# EasyEDA Pro project 外接板20250814.eprj

# Schematic Schematic1
Board Name: Board1; Create Date: 2025-08-14; Page Name: P1; Project Name: 外接板20250814; Schematic Name: Schematic1; Update Date: 2025-09-02; Company: 嘉立创EDA; Page Size: A4; Version: V1.0
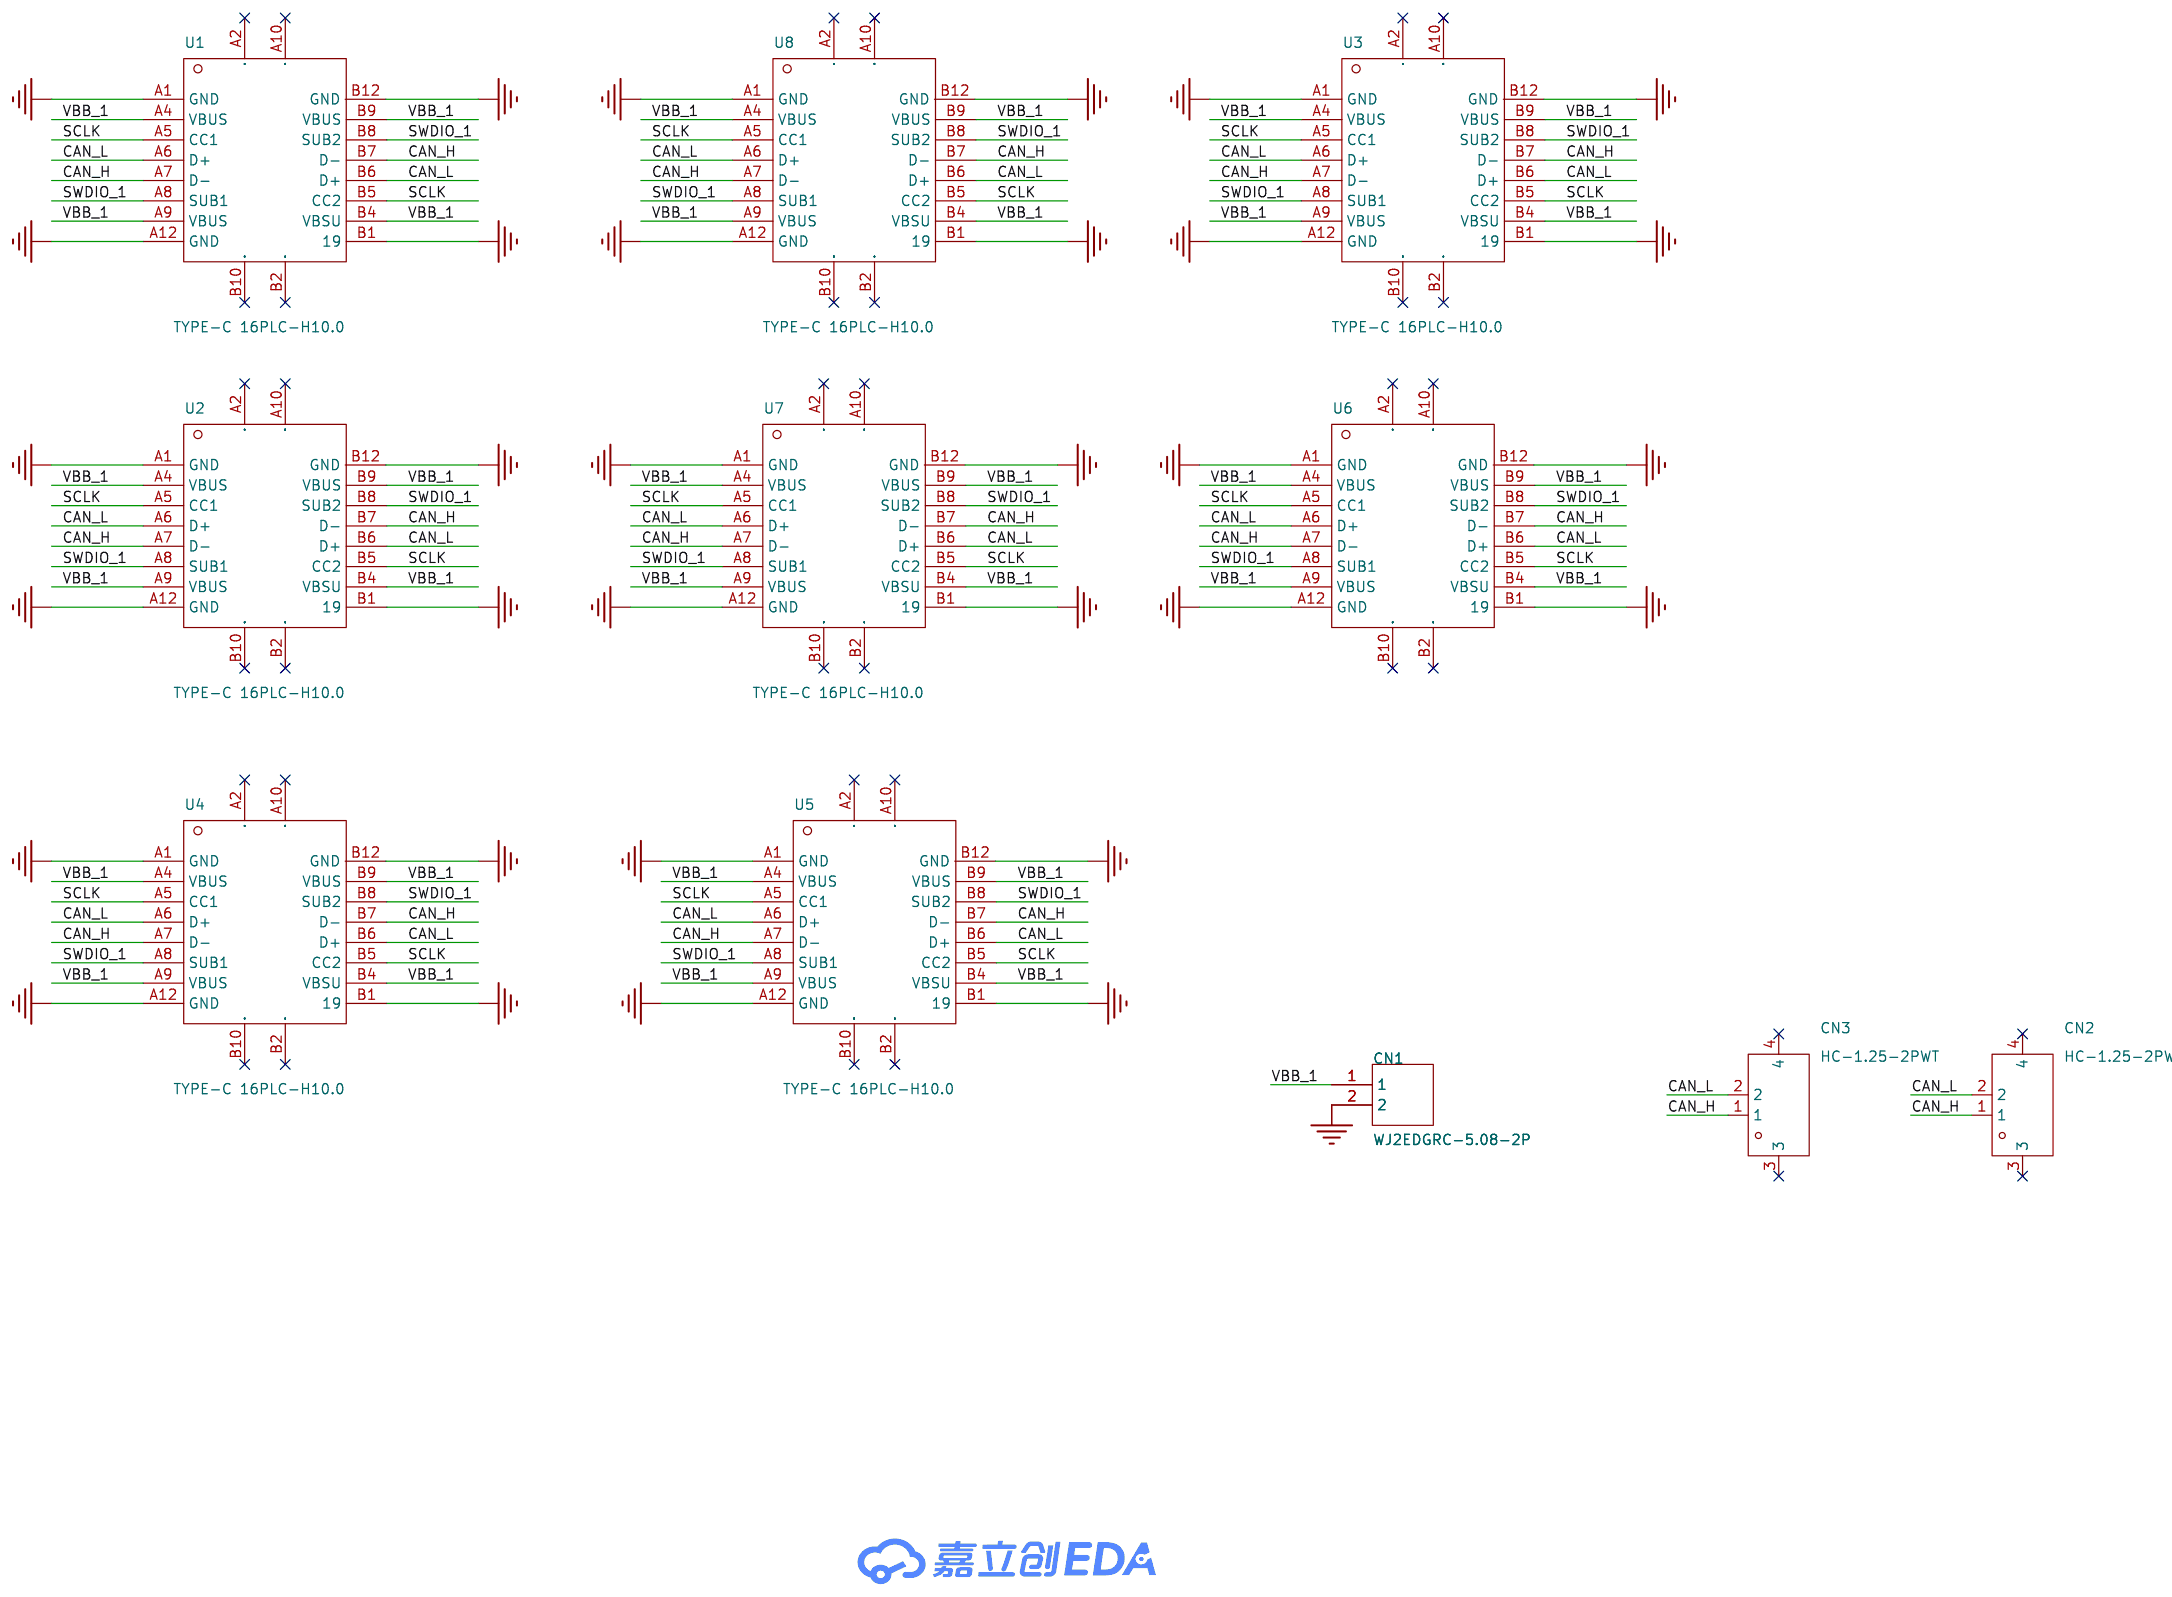
[diagram p0: schematic sheet]

## Parts
CN1  WJ2EDGRC-5.08-2P  [CONN-TH_2P-P5.08_WJ2EDGRC-5.08-2P]
CN2  HC-1.25-2PWT  [CONN-SMD_2P-P1.25-HC-1.25-2PWT]
CN3  HC-1.25-2PWT  [CONN-SMD_2P-P1.25-HC-1.25-2PWT]
U1  TYPE-C 16PLC-H10.0  [TYPE-C-TH_16PLC-H10.0]
U2  TYPE-C 16PLC-H10.0  [TYPE-C-TH_16PLC-H10.0]
U3  TYPE-C 16PLC-H10.0  [TYPE-C-TH_16PLC-H10.0]
U4  TYPE-C 16PLC-H10.0  [TYPE-C-TH_16PLC-H10.0]
U5  TYPE-C 16PLC-H10.0  [TYPE-C-TH_16PLC-H10.0]
U6  TYPE-C 16PLC-H10.0  [TYPE-C-TH_16PLC-H10.0]
U7  TYPE-C 16PLC-H10.0  [TYPE-C-TH_16PLC-H10.0]
U8  TYPE-C 16PLC-H10.0  [TYPE-C-TH_16PLC-H10.0]

## Library data of the parts
CN1 = WJ2EDGRC-5.08-2P: 连接器类型:板端/插座-闭口;固定方式:-;结构:1x2P;间距:5.08mm;颜色:绿色;安装方式:弯针;排数:1;每排PIN数:2;额定电流:20A;额定电压:450V;线规 - AWG:-;线规 - 平方毫米:-;触头材质:黄铜;触头镀层:锡;工作温度范围:-40℃~+105℃;焊接温度(最大值):-;; LCSC Part Name: 1x2P 5.08mm 排数:1 每排P数:2; Supplier Part: C3697; Manufacturer: KANGNEX(康奈克斯电气); Supplier Footprint: 弯插,P=5.08mm; JLCPCB Part Class: 扩展库; Datasheet: https://atta.szlcsc.com/upload/public/pdf/source/20240813/4D8AF133EBD88DD18E5AA0CE5EC77AA3.pdf; Supplier: LCSC; Connector Type: 板端/插座-闭口; Structure: 1x2P; Pitch: 5.08mm; Color: 绿色; Mounting Style: 弯针; Number of Pins: 2P; Number of Rows: 1; Number of PINs Per Row: 2; Current Rating (Max): 20A; Voltage Rating (Max): 450V; Contact Material: 黄铜; Contact Plating: 锡; Operating Temperature Range: -40℃~+105℃
CN2 CN3 = HC-1.25-2PWT: 插针结构:1x2P;间距:1.25mm;安装方式:卧贴;参考系列:PicoBlade(MX 1.25);总PIN数:2P;排数:1;每排PIN数:2;行距:-;额定电流:1A;触头材质:黄铜;触头镀层:锡;工作温度范围:-40℃~+105℃;; LCSC Part Name: 1x2P 间距:1.25mm 卧贴 系列:PicoBlade(MX 1.25); Supplier Part: C2845379; Manufacturer: HCTL(华灿天禄); Supplier Footprint: SMD,P=1.25mm,卧贴; JLCPCB Part Class: 扩展库; Datasheet: https://atta.szlcsc.com/upload/public/pdf/source/20240930/9508A8292CCC87B0C29E3A028D56E30A.pdf; Supplier: LCSC; Pins Structure: 1x2P; Pitch: 1.25mm; Mounting Style: 卧贴; Reference Series: PicoBlade(MX 1.25); Number of Pins: 2P; Number of Rows: 1; Number of PINs Per Row: 2; Current Rating (Max): 1A; Contact Material: 黄铜; Contact Plating: 锡; Operating Temperature Range: -40℃~+105℃; Rated Voltage (Max): 125V; Plastic Material: LCP; Flame Retardant Rating: UL94V-0; Supplementary Features: 辅助焊脚; Z-Height of the Board: 3.57mm; X-Length of Bottom Edge on Board (Spacing Line): 7.55mm; Y-Width of Bottom Edge on Board: 5.25mm
U1-U8 = TYPE-C 16PLC-H10.0: 连接器类型:Type-C;标准:USB 3.1;公母:母;安装方式:直插;触点数量:16P;端口数量:1;额定电流 - 电源:5A;触头材质:-;触头镀层:-;工作温度范围:-40℃~+85℃;; LCSC Part Name: Type-C 母 直插; Supplier Part: C3151747; Manufacturer: SHOU HAN(首韩); Supplier Footprint: 插件; JLCPCB Part Class: 扩展库; Datasheet: https://atta.szlcsc.com/upload/public/pdf/source/20240529/CC9428849977884A813B584EA396EFE9.pdf; Supplier: LCSC; Connector Type: Type-C; Standard: USB 3.1; Gender: 母; Mounting Style: 直插; Number of Contacts: 16P; Number of Ports: 1; Current Rating - Power (Max): 5A; Operating Temperature Range: -40℃~+85℃; Rated Voltage (Max): 20V; Connect-Disconnect Life: 1万次; Core Colour: 黑色

## Nets
GND: CN1.2 U1.A1(GND) U1.A12(GND) U1.B1(19) U1.B12(GND) U2.A1(GND) U2.A12(GND) U2.B1(19) U2.B12(GND) U3.A1(GND) U3.A12(GND) U3.B1(19) U3.B12(GND) U4.A1(GND) U4.A12(GND) U4.B1(19) U4.B12(GND) U5.A1(GND) U5.A12(GND) U5.B1(19) U5.B12(GND) U6.A1(GND) U6.A12(GND) U6.B1(19) U6.B12(GND) U7.A1(GND) U7.A12(GND) U7.B1(19) U7.B12(GND) U8.A1(GND) U8.A12(GND) U8.B1(19) U8.B12(GND)
CAN_H: CN2.1 CN3.1 U1.A7(D-) U1.B7(D-) U2.A7(D-) U2.B7(D-) U3.A7(D-) U3.B7(D-) U4.A7(D-) U4.B7(D-) U5.A7(D-) U5.B7(D-) U6.A7(D-) U6.B7(D-) U7.A7(D-) U7.B7(D-) U8.A7(D-) U8.B7(D-)
CAN_L: CN2.2 CN3.2 U1.A6(D+) U1.B6(D+) U2.A6(D+) U2.B6(D+) U3.A6(D+) U3.B6(D+) U4.A6(D+) U4.B6(D+) U5.A6(D+) U5.B6(D+) U6.A6(D+) U6.B6(D+) U7.A6(D+) U7.B6(D+) U8.A6(D+) U8.B6(D+)
SCLK: U1.A5(CC1) U1.B5(CC2) U2.A5(CC1) U2.B5(CC2) U3.A5(CC1) U3.B5(CC2) U4.A5(CC1) U4.B5(CC2) U5.A5(CC1) U5.B5(CC2) U6.A5(CC1) U6.B5(CC2) U7.A5(CC1) U7.B5(CC2) U8.A5(CC1) U8.B5(CC2)
SWDIO_1: U1.A8(SUB1) U1.B8(SUB2) U2.A8(SUB1) U2.B8(SUB2) U3.A8(SUB1) U3.B8(SUB2) U4.A8(SUB1) U4.B8(SUB2) U5.A8(SUB1) U5.B8(SUB2) U6.A8(SUB1) U6.B8(SUB2) U7.A8(SUB1) U7.B8(SUB2) U8.A8(SUB1) U8.B8(SUB2)
VBB_1: CN1.1 U1.A4(VBUS) U1.A9(VBUS) U1.B4(VBSU) U1.B9(VBUS) U2.A4(VBUS) U2.A9(VBUS) U2.B4(VBSU) U2.B9(VBUS) U3.A4(VBUS) U3.A9(VBUS) U3.B4(VBSU) U3.B9(VBUS) U4.A4(VBUS) U4.A9(VBUS) U4.B4(VBSU) U4.B9(VBUS) U5.A4(VBUS) U5.A9(VBUS) U5.B4(VBSU) U5.B9(VBUS) U6.A4(VBUS) U6.A9(VBUS) U6.B4(VBSU) U6.B9(VBUS) U7.A4(VBUS) U7.A9(VBUS) U7.B4(VBSU) U7.B9(VBUS) U8.A4(VBUS) U8.A9(VBUS) U8.B4(VBSU) U8.B9(VBUS)

Not connected (* = marked no-connect by the designer): CN2 3* 4*; CN3 3* 4*; U1 A2(GND1)* A10(GND2)* B2(GND4)* B10(GND3)*; U2 A2(GND1)* A10(GND2)* B2(GND4)* B10(GND3)*; U3 A2(GND1)* A10(GND2)* B2(GND4)* B10(GND3)*; U4 A2(GND1)* A10(GND2)* B2(GND4)* B10(GND3)*; U5 A2(GND1)* A10(GND2)* B2(GND4)* B10(GND3)*; U6 A2(GND1)* A10(GND2)* B2(GND4)* B10(GND3)*; U7 A2(GND1)* A10(GND2)* B2(GND4)* B10(GND3)*; U8 A2(GND1)* A10(GND2)* B2(GND4)* B10(GND3)*

# Board PCB5
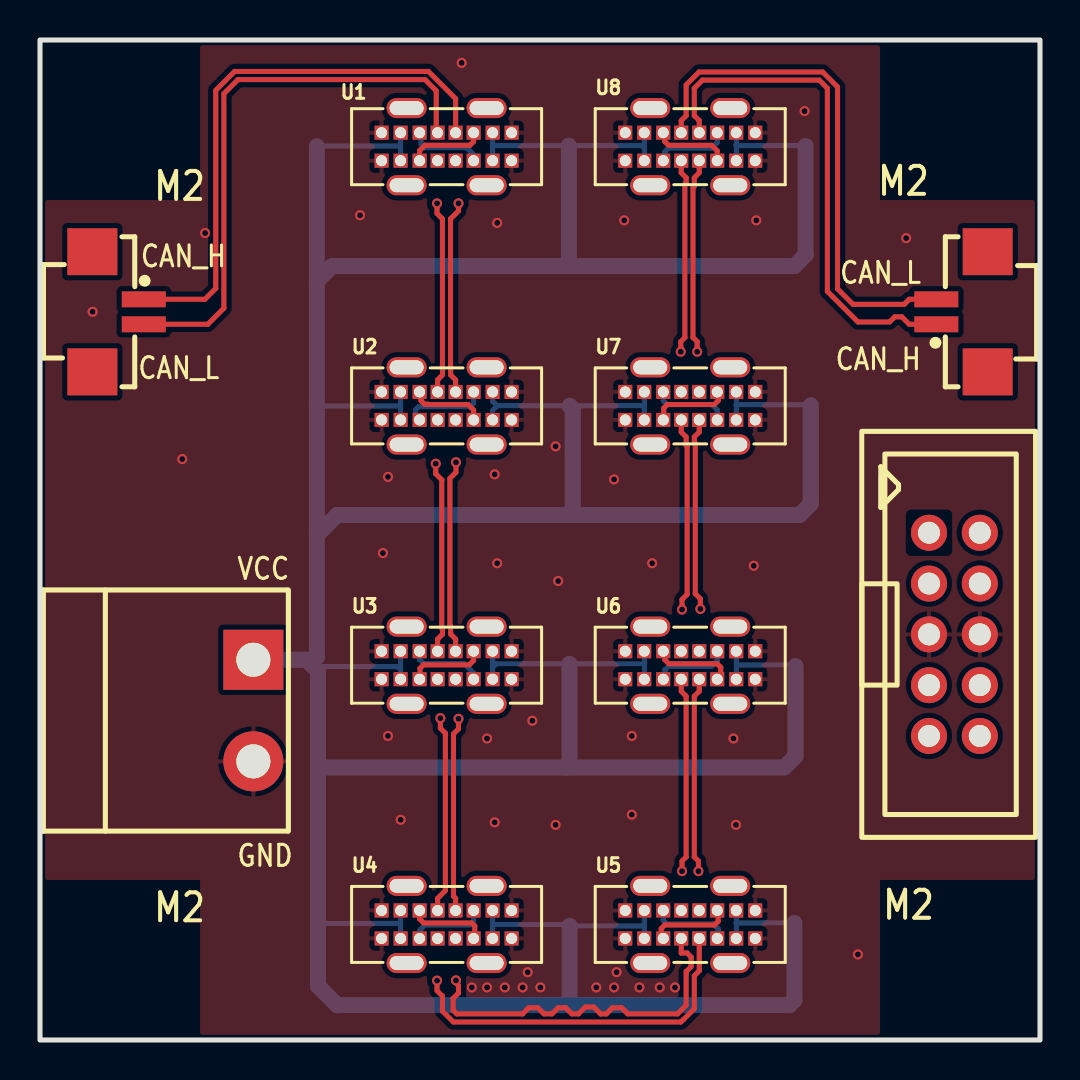
[diagram p1: board, top side]
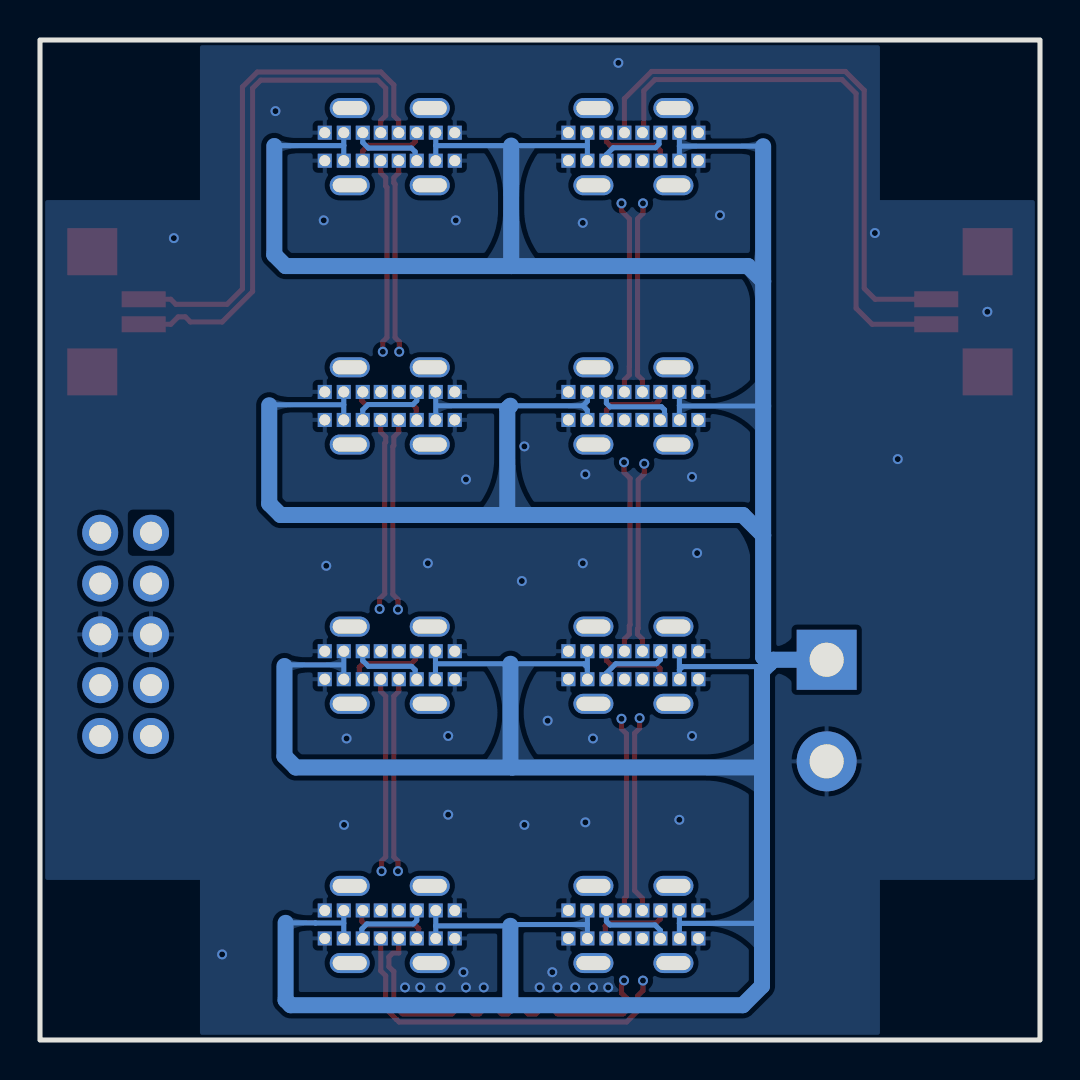
[diagram p2: board, bottom side, seen from below]

Outline 50 x 50 mm; copper layers: Top Layer, 内层1, 内层2, Bottom Layer. Coordinates in mm from the lower left corner of the outline.
Outline path: rectangle 0,50 50,0
Stack: Top Layer 0.035mm 外层铜厚1oz / Dielectric1 0.2104mm 7628 RC49% 8.6mil / 内层1 0.0152mm 内层铜厚 / Dielectric2 1.065mm 1.1mm H/HOZ Copper / 内层2 0.0152mm 内层铜厚 / Dielectric3 0.2104mm 7628 RC49% 8.6mil / Bottom Layer 0.035mm 外层铜厚1oz

## Design rules (mm)
net CAN_L: DP1
net CAN_H: DP1
template: JLCPCB Capability(Two Layers Board)
spacing copperThickness1oz (default): track to track 0.102, other pairs 0.152 to 0.3
spacing copperThickness2oz: track to track 0.203, other pairs 0.152 to 0.3
track width copperThickness1oz (default): min 0.127, default 0.254, max 2.54
track width copperThickness2oz: min 0.203, default 0.254, max 2.54
differential pair differentialPair (default): width min 0.127, default 0.254, max 2.54; gap min 0.152, default 0.152
via viaSize (default): diameter min 0.5, default 0.61, max 10; hole min 0.3, default 0.305, max 6.3

## Placement (name value [footprint] x y rotation side)
CN1  WJ2EDGRC-5.08-2P  [CONN-TH_2P-P5.08_WJ2EDGRC-5.08-2P]  10.67 16.47 270 top
CN2  HC-1.25-2PWT  [CONN-SMD_2P-P1.25-HC-1.25-2PWT]  46.1 36.41 90 top
CN3  HC-1.25-2PWT  [CONN-SMD_2P-P1.25-HC-1.25-2PWT]  3.9 36.41 270 top
NOREF  -  [Pad_e233]  44.45 20.28 0 top
NOREF#2  -  [Pad_e232]  46.99 20.28 0 top
NOREF#3  -  [Pad_e249]  44.45 22.82 0 top
NOREF#4  -  [Pad_e236]  46.99 17.74 0 top
NOREF#5  -  [Pad_e247]  44.45 15.2 0 top
NOREF#6  -  [Pad_e237]  46.99 15.2 0 top
NOREF#7  -  [Pad_e250]  44.45 25.36 0 top
NOREF#8  -  [Pad_e248]  44.45 17.74 0 top
NOREF#9  -  [Pad_e229]  46.99 22.82 0 top
NOREF#10  -  [Pad_e231]  46.99 25.36 0 top
U1  TYPE-C 16PLC-H10.0  [TYPE-C-TH_16PLC-H10.0]  20.33 44.67 0 top
U2  TYPE-C 16PLC-H10.0  [TYPE-C-TH_16PLC-H10.0]  20.33 31.7 0 top
U3  TYPE-C 16PLC-H10.0  [TYPE-C-TH_16PLC-H10.0]  20.33 18.74 0 top
U4  TYPE-C 16PLC-H10.0  [TYPE-C-TH_16PLC-H10.0]  20.33 5.78 0 top
U5  TYPE-C 16PLC-H10.0  [TYPE-C-TH_16PLC-H10.0]  32.51 5.78 0 top
U6  TYPE-C 16PLC-H10.0  [TYPE-C-TH_16PLC-H10.0]  32.51 18.74 0 top
U7  TYPE-C 16PLC-H10.0  [TYPE-C-TH_16PLC-H10.0]  32.51 31.7 0 top
U8  TYPE-C 16PLC-H10.0  [TYPE-C-TH_16PLC-H10.0]  32.51 44.67 0 top

## Footprints (pads in the part's own frame, mm; a bottom-side part is the same pattern mirrored in y, then rotated)
CONN-SMD_2P-P1.25-HC-1.25-2PWT
  rect 0.8x2.2 smd: 1(-0.625,1.285) 2(0.625,1.285)
  rect 2.35x2.5 smd: 3(-3.005,-1.285) 4(3.005,-1.285)
CONN-TH_2P-P5.08_WJ2EDGRC-5.08-2P
  rect 3x3 hole 1.7: 1(-2.54,0)
  round 3 hole 1.7: 2(2.54,0)
Pad_e229
  round 1.8 hole 1.1: 1(0,0)
Pad_e231
  round 1.8 hole 1.1: 1(0,0)
Pad_e232
  round 1.8 hole 1.1: 1(0,0)
Pad_e233
  round 1.8 hole 1.1: 1(0,0)
Pad_e236
  round 1.8 hole 1.1: 1(0,0)
Pad_e237
  round 1.8 hole 1.1: 1(0,0)
Pad_e247
  round 1.8 hole 1.1: 1(0,0)
Pad_e248
  round 1.8 hole 1.1: 1(0,0)
Pad_e249
  round 1.8 hole 1.1: 1(0,0)
Pad_e250
  round 1.8 hole 1.1: 1(0,0)
TYPE-C-TH_16PLC-H10.0
  rect 0.7x0.7 hole 0.55: A1(-3.25,0.7) A4(-2.3,0.7) A5(-1.351,0.7) A6(-0.45,0.7) A7(0.45,0.7) A8(1.35,0.7) A9(2.3,0.7) A12(3.25,0.7) B1(3.25,-0.7) B4(2.3,-0.7) B5(1.35,-0.7) B6(0.45,-0.7) B7(-0.45,-0.7) B8(-1.351,-0.7) B9(-2.3,-0.7) B12(-3.25,-0.7)
  oval 2x1 hole 1.7x0.7: A2(-2,1.93) A10(2,1.93) B2(2,-1.93) B10(-2,-1.93)

## Nets
GND: CN1.2 NOREF.1 NOREF#2.1 U1.A1 U1.A12 U1.B1 U1.B12 U2.A1 U2.A12 U2.B1 U2.B12 U3.A1 U3.A12 U3.B1 U3.B12 U4.A1 U4.A12 U4.B1 U4.B12 U5.A1 U5.A12 U5.B1 U5.B12 U6.A1 U6.A12 U6.B1 U6.B12 U7.A1 U7.A12 U7.B1 U7.B12 U8.A1 U8.A12 U8.B1 U8.B12
CAN_H: CN2.1 CN3.1 U1.A7 U1.B7 U2.A7 U2.B7 U3.A7 U3.B7 U4.A7 U4.B7 U5.A7 U5.B7 U6.A7 U6.B7 U7.A7 U7.B7 U8.A7 U8.B7
CAN_L: CN2.2 CN3.2 U1.A6 U1.B6 U2.A6 U2.B6 U3.A6 U3.B6 U4.A6 U4.B6 U5.A6 U5.B6 U6.A6 U6.B6 U7.A6 U7.B6 U8.A6 U8.B6
SCLK: NOREF#10.1 U1.A5 U1.B5 U2.A5 U2.B5 U3.A5 U3.B5 U4.A5 U4.B5 U5.A5 U5.B5 U6.A5 U6.B5 U7.A5 U7.B5 U8.A5 U8.B5
SWDIO_1: NOREF#9.1 U1.A8 U1.B8 U2.A8 U2.B8 U3.A8 U3.B8 U4.A8 U4.B8 U5.A8 U5.B8 U6.A8 U6.B8 U7.A8 U7.B8 U8.A8 U8.B8
VBB_1: CN1.1 U1.A4 U1.A9 U1.B4 U1.B9 U2.A4 U2.A9 U2.B4 U2.B9 U3.A4 U3.A9 U3.B4 U3.B9 U4.A4 U4.A9 U4.B4 U4.B9 U5.A4 U5.A9 U5.B4 U5.B9 U6.A4 U6.A9 U6.B4 U6.B9 U7.A4 U7.A9 U7.B4 U7.B9 U8.A4 U8.A9 U8.B4 U8.B9

Pads without a net: CN2 3 4; CN3 3 4; NOREF#3 1; NOREF#4 1; NOREF#5 1; NOREF#6 1; NOREF#7 1; NOREF#8 1; U1 A2 A10 B2 B10; U2 A2 A10 B2 B10; U3 A2 A10 B2 B10; U4 A2 A10 B2 B10; U5 A2 A10 B2 B10; U6 A2 A10 B2 B10; U7 A2 A10 B2 B10; U8 A2 A10 B2 B10

## Via types
v1: diameter 0.5, hole 0.3, Top Layer to Bottom Layer, 56 vias

## Routing (per net, layer and track width the routed paths; a pad name or vN(x,y) marks a point on that pad's centre or on a via; arc(x,y) is an arc through that point)
GND:
  vias: v1(2.63,36.41) v1(7.11,29.05) v1(8.25,40.35) v1(16,41.24) v1(17.15,24.35) v1(17.4,28.16) v1(17.4,15.2) v1(18.03,11.01) v1(21.08,48.86) v1(21.59,2.63) v1(22.35,15.08) v1(22.35,2.63) v1(22.73,28.28) v1(22.73,10.88) v1(22.86,40.86) v1(22.86,23.84) v1(23.24,2.63) v1(24.13,2.63) v1(24.38,3.39) v1(24.62,15.96) v1(25.02,2.63) v1(25.78,29.68) v1(25.78,10.76) v1(25.91,22.95) v1(27.81,2.63) v1(28.7,28.03) v1(28.7,2.63) v1(28.83,3.39) v1(29.21,40.98) v1(29.59,15.2) v1(29.59,11.27) v1(29.97,2.63) v1(30.61,23.84) v1(30.99,2.63) v1(31.75,2.63) v1(34.67,15.08) v1(34.8,10.76) v1(35.69,23.71) v1(35.81,40.98) v1(38.23,46.44) v1(40.89,4.28) v1(43.31,40.09)
CAN_H: length 164.8
  Top Layer w0.254: U8.A7 32.96,45.97 32.72,46.22 32.72,47.59 33.12,47.99 38.96,47.99 39.37,47.59 39.37,37.43 40.89,35.9 42.48,35.9 42.74,36.16 43.09,36.16 43.46,35.79 CN2.1 ; v1(20.8,28.89) 20.8,28.38 20.5,28.08 20.5,20.75 20.53,20.71 20.53,20.29 20.78,20.04 U3.A7 ; v1(32.1,8.44) 32.1,8.95 32.31,9.15 32.31,17.19 32.06,17.44 U6.B7 ; U5.B7 32.06,4.35 32.36,4.35 32.56,4.15 32.56,3.67 32.32,3.43 32.31,3.43 32.31,1.74 31.88,1.31 29.39,1.31 29.08,1.61 28.63,1.61 28.32,1.31 28.03,1.31 27.69,1.65 27.27,1.65 26.92,1.31 26.6,1.31 26.29,1.61 25.91,1.61 25.6,1.31 25.2,1.31 24.89,1.61 24.44,1.61 24.13,1.31 20.84,1.31 20.66,1.49 20.66,2.08 20.93,2.35 20.93,2.73 20.8,2.85 v1(20.8,2.98) ; v1(32.04,34.41) 32.04,34.92 32.25,35.12 32.25,42.8 32.31,42.86 32.31,43.11 32.06,43.36 U8.B7 ; U7.B7 32.06,30.4 32.31,30.15 32.31,29.73 32.36,29.68 32.36,22.28 32.1,22.03 v1(32.1,21.52) ; U1.A7 20.78,47.07 19.42,48.43 9.73,48.43 8.79,47.49 8.79,37.58 8.25,37.04 CN3.1 ; v1(20.93,16.06) 20.93,15.56 20.68,15.31 20.68,7.19 20.78,7.08 U4.A7 ; v1(20.93,41.83) 20.93,41.46 20.53,41.06 20.53,33.68 20.53,33.68 20.53,33.25 20.78,33.01 U2.A7
  内层1 w0.254: v1(20.8,28.89) 19.88,29.81 U2.B7 19.88,31.47 20.07,31.66 20.57,31.66 20.78,31.87 U2.A7 ; U6.B7 32.06,18.56 32.26,18.76 32.71,18.76 32.96,19.01 U6.A7 32.96,20.66 v1(32.1,21.52) ; U1.A7 20.78,44.87 20.57,44.67 20.07,44.67 19.88,44.48 U1.B7 19.94,43.9 19.94,42.95 20.86,42.03 20.86,41.9 v1(20.93,41.83) ; U8.B7 32.06,44.44 32.26,44.63 32.8,44.63 32.96,44.79 U8.A7 ; v1(20.8,2.98) 19.88,3.9 U4.B7 19.88,5.63 20.04,5.78 20.55,5.78 20.78,6.01 U4.A7 ; U3.A7 20.78,18.96 20.56,18.75 20.07,18.75 19.88,18.56 U3.B7 20.01,17.91 20.01,16.98 v1(20.93,16.06) ; v1(32.04,34.41) 32.96,33.49 U7.A7 32.96,31.84 32.8,31.68 32.22,31.68 32.06,31.52 U7.B7 ; U5.B7 32.06,5.59 32.26,5.79 32.75,5.79 32.78,5.75 32.96,5.93 U5.A7 32.96,7.58 v1(32.1,8.44)
CAN_L: length 164.9
  Top Layer w0.254: U7.B6 32.96,30.4 32.72,30.15 32.72,29.9 32.76,29.85 32.76,22.31 33.02,22.06 v1(33.02,21.55) ; v1(32.86,34.41) 32.86,34.92 32.65,35.12 32.65,42.63 32.72,42.69 32.72,43.11 32.96,43.36 U8.B6 ; v1(19.79,28.81) 19.79,28.31 20.09,28.01 20.09,20.58 20.13,20.55 20.13,20.29 19.88,20.04 U3.A6 ; CN3.2 8.39,35.79 9.19,36.59 9.19,47.32 9.9,48.02 19.25,48.02 19.81,47.46 19.81,45.43 ; U2.A6 19.88,33.01 20.13,33.25 20.13,33.51 20.12,33.51 20.12,41.06 19.85,41.33 v1(19.85,41.83) ; U6.B6 32.96,17.44 32.72,17.19 32.72,9.15 32.92,8.95 v1(32.92,8.44) ; v1(19.85,2.97) 19.85,2.47 20.12,2.2 20.12,1.44 20.67,0.9 32.05,0.9 32.17,1.03 32.18,1.03 32.72,1.56 32.72,3.21 32.96,3.46 U5.B6 ; U4.A6 19.88,7.08 20.27,7.47 20.27,15.34 20.02,15.59 v1(20.02,16.09) ; CN2.2 43.46,37.04 43.21,36.78 40.65,36.78 39.88,37.55 39.88,47.65 39.13,48.4 32.95,48.4 32.31,47.76 32.31,46.22 32.06,45.97 U8.A6
  内层2 w0.254: v1(32.86,34.41) 32.06,33.62 U7.A6 32.06,31.84 32.22,31.68 32.77,31.68 32.96,31.48 U7.B6 ; v1(19.85,2.97) 20.78,3.9 U4.B6 20.78,5.6 20.57,5.8 20.07,5.8 19.88,5.99 U4.A6 ; v1(19.79,28.81) 20.78,29.81 U2.B6 20.78,31.51 20.57,31.71 20.07,31.71 19.88,31.9 U2.A6 ; U3.A6 19.88,18.94 20.07,18.76 20.57,18.76 20.78,18.55 U3.B6 20.78,16.73 20.15,16.09 v1(20.02,16.09) ; U8.B6 32.96,44.47 32.77,44.67 32.26,44.67 32.06,44.86 U8.A6 ; v1(32.92,8.44) 32.06,7.58 U5.A6 32.06,5.93 32.22,5.77 32.77,5.77 32.96,5.57 U5.B6 ; v1(19.85,41.83) 19.98,41.83 20.91,42.76 20.91,43.84 U1.B6 20.78,44.4 20.52,44.67 20.07,44.67 19.88,44.85 U1.A6 ; U6.B6 32.96,18.47 32.77,18.66 32.53,18.66 32.53,18.67 32.22,18.67 32.06,18.83 U6.A6 32.06,20.59 v1(33.02,21.55)
SCLK: length 160.3
  Top Layer w0.254: U6.A5 31.24,19.36 31.24,19.01 31.44,18.81 33.86,18.81 34.04,18.64 34.04,18.11 33.97,18.04 U6.B5 ; U2.B5 21.68,31.5 21.4,31.77 19.41,31.77 19.4,31.79 19.23,31.79 19.05,31.97 19.05,32.33 U2.A5 ; U4.B5 21.74,5.14 21.74,5.7 21.59,5.85 19.19,5.85 18.98,6.06 U4.A5 ; U8.A5 31.24,45.29 31.24,44.92 31.43,44.74 33.58,44.74 33.86,44.46 U8.B5
  内层2 w0.254: 37.57,31.71 37.57,44.43 37.29,44.72 34.04,44.72 33.86,44.54 U8.B5 ; 37.57,31.71 37.51,31.76 34.09,31.76 33.91,31.58 33.91,31.05 U7.B5 ; 37.57,31.71 37.57,28.27 ; 25.15,18.64 25.1,18.68 21.9,18.68 21.72,18.5 21.72,18.08 U3.B5 ; 25.15,18.64 25.15,5.8 25.07,5.73 ; 25.15,18.64 25.15,31.76 ; 25.15,31.76 25.15,44.41 24.96,44.59 21.79,44.59 21.72,44.52 21.72,44 U1.B5 ; 25.15,31.76 21.9,31.76 21.72,31.58 21.72,31.04 U2.B5 ; 37.57,28.27 46.37,28.27 47.12,27.52 47.12,25.49 NOREF#10.1 ; 37.57,28.27 37.57,18.66 ; U4.B5 21.72,5.11 21.72,5.55 21.9,5.73 25.07,5.73 ; 25.07,5.73 30.86,5.73 31.16,6.03 U5.A5 ; 37.57,18.66 37.55,18.68 34.09,18.68 33.91,18.5 33.91,18.09 U6.B5 ; 37.57,18.66 37.57,6.33 37.08,5.85 33.91,5.85 33.86,5.8 U5.B5
  Bottom Layer w0.254: U3.B5 21.68,18.34 21.21,18.81 19.18,18.81 18.98,19.01 U3.A5 ; U1.A5 19.05,45.3 19.05,44.79 19.23,44.61 21.34,44.61 21.68,44.27 U1.B5 ; U7.B5 33.86,31.5 33.59,31.77 31.35,31.77 31.16,31.97 U7.A5 ; U5.B5 33.91,5.12 33.91,5.55 33.66,5.8 31.34,5.8 31.16,5.98 U5.A5
SWDIO_1: length 132
  Top Layer w0.254: U3.B8 19,18.06 19,18.58 19.18,18.76 21.46,18.76 21.68,18.97 U3.A8 ; U1.A8 21.68,44.92 21.5,44.74 19.25,44.74 18.98,44.47 U1.B8 ; U5.A8 33.91,6.43 33.91,5.93 33.73,5.75 31.24,5.75 31.06,5.57 31.06,5.18 U5.B8 ; U7.B8 31.19,31.03 31.19,31.59 31.37,31.77 33.72,31.77 33.91,31.97 33.91,32.36 U7.A8
  内层1 w0.254: U4.A8 21.72,6.44 21.72,5.93 21.9,5.75 26.4,5.75 ; 26.54,44.74 24.05,44.74 24.05,44.74 22.16,44.74 22.16,44.74 21.9,44.74 21.72,44.92 21.72,45.33 U1.A8 ; 26.54,44.74 26.59,44.74 26.61,44.72 31.06,44.72 31.24,44.54 31.24,44.05 U8.B8 ; 26.54,44.74 26.54,31.86 ; 26.51,18.71 26.4,18.59 26.4,5.75 ; 26.51,18.71 26.54,18.74 ; 26.51,18.71 21.9,18.71 21.72,18.89 21.72,19.4 U3.A8 ; U7.B8 31.16,31.58 30.98,31.76 26.64,31.76 26.54,31.86 ; 26.54,31.86 26.54,18.74 ; 26.54,31.86 26.45,31.77 22.16,31.77 21.68,32.26 U2.A8 ; 26.4,5.75 30.79,5.75 31.16,5.38 U5.B8 ; 26.54,18.74 26.62,18.81 30.98,18.81 31.16,18.63 U6.B8 ; U6.A8 33.86,18.93 34.1,18.69 38.86,18.69 39.37,19.2 39.37,23.46 39.94,24.03 45.85,24.03 46.99,22.89 NOREF#9.1
  Bottom Layer w0.254: U4.B8 18.98,5.48 19.25,5.75 21.5,5.75 21.68,5.93 U4.A8 ; U8.B8 31.24,44.05 31.24,44.41 31.43,44.59 33.58,44.59 33.86,44.87 U8.A8 ; U2.A8 21.68,31.84 21.5,31.66 18.92,31.66 18.77,31.51 18.77,31.19 18.97,31 U2.B8 ; U6.A8 33.86,18.97 33.58,18.68 31.42,18.68 31.24,18.5 31.24,18.12 U6.B8
VBB_1: length 266.1
  Bottom Layer w0.254: 30.21,44.72 26.44,44.72 26.44,44.72 22.63,44.72 ; 30.21,44.72 U8.B9 ; 30.21,44.72 U8.A4 ; U6.B9 30.23,18.05 30.23,18.84 ; 18.03,44.69 U1.A4 ; 18.03,44.69 U1.B9 ; 18.03,44.69 13.85,44.69 13.84,44.69 ; 30.23,18.84 30.2,18.81 22.81,18.81 22.63,18.63 ; 30.23,18.84 30.23,19.43 U6.A4 ; 22.63,5.77 U4.B4 ; 22.63,5.77 26.42,5.77 26.48,5.71 30.21,5.71 30.21,5.71 ; 22.63,5.77 U4.A9 ; 37.72,5.86 36.24,5.86 36.23,5.85 34.83,5.85 34.81,5.84 ; U4.B9 18.03,5.83 ; 18.03,5.83 13.92,5.83 13.9,5.85 ; 18.03,5.83 U4.A4 ; 30.21,5.71 U5.A4 ; 30.21,5.71 U5.B9 ; U7.B4 U7.A9 ; U8.A9 34.81,44.73 ; 34.81,44.73 34.82,44.72 38.26,44.72 38.28,44.7 ; 34.81,44.73 U8.B4 ; 34.81,31.76 38.51,31.76 38.54,31.73 ; U3.A9 22.63,18.63 ; 22.63,18.63 U3.B4 ; 34.93,18.76 37.72,18.76 37.78,18.7 ; 18.03,31.72 U2.B9 ; 18.03,31.72 18,31.7 13.84,31.7 ; 18.03,31.72 U2.A4 ; U5.A9 34.81,5.84 ; 34.81,5.84 U5.B4 ; U2.B4 22.63,31.48 22.86,31.71 ; U7.A4 U7.B9 ; 30.1,31.71 22.86,31.71 ; U3.A4 18.03,18.51 ; 18.03,18.51 U3.B9 ; 18.03,18.51 17.87,18.67 14.12,18.67 13.9,18.45 ; 22.63,44.72 U1.B4 ; 22.63,44.72 U1.A9 ; 22.86,31.71 22.63,31.94 U2.A9 ; U6.A9 U6.B4
  Bottom Layer w0.8: 13.9,13.5 13.9,2.7 14.86,1.74 26.42,1.74 ; 13.9,13.5 14.03,13.63 26.39,13.63 ; 13.9,13.5 13.9,18.45 13.52,18.82 ; 26.42,1.74 26.48,1.81 26.48,5.71 ; 26.42,1.74 37.47,1.74 37.72,1.99 37.72,5.86 ; 37.78,18.7 37.78,14.19 37.21,13.63 26.39,13.63 ; 26.64,26.25 26.64,31.56 26.48,31.71 ; 26.64,26.25 14.86,26.25 13.84,25.23 ; 26.64,26.25 37.97,26.25 38.54,26.82 38.54,31.73 ; 13.52,18.82 13.34,19.01 CN1.1 ; 13.52,18.82 13.84,19.14 13.84,25.23 ; 13.84,25.23 13.84,37.94 ; 38.28,44.7 38.28,39.26 37.72,38.7 26.44,38.7 ; 26.44,38.7 14.6,38.7 13.84,37.94 ; 26.44,38.7 26.44,44.72 ; 26.39,13.63 26.47,13.71 26.47,18.81 ; 13.84,37.94 13.84,44.69

## Copper pours and planes (outline as drawn; the poured copper is in the pictures)
GND on Top Layer: -0.89,51.65 53.09,51.65 53.09,-3.09 -0.89,-3.09
GND on Bottom Layer: -1.84,51.31 52.13,51.31 52.13,-3.43 -1.84,-3.43
GND on 内层1: -2.48,51.08 51.5,51.08 51.5,-3.66 -2.48,-3.66
GND on 内层2: -2.6,51.46 51.37,51.46 51.37,-3.28 -2.6,-3.28

Small or netless copper shapes (teardrops, artwork), in the pictures only: 17 on Top Layer, 21 on Bottom Layer, 16 on 内层1, 13 on 内层2

## Text on the board
Top Silkscreen Layer: CAN_L | CAN_H | VCC | GND | M2
